# EAGLE design groundControl (EAGLE 9.5.1)
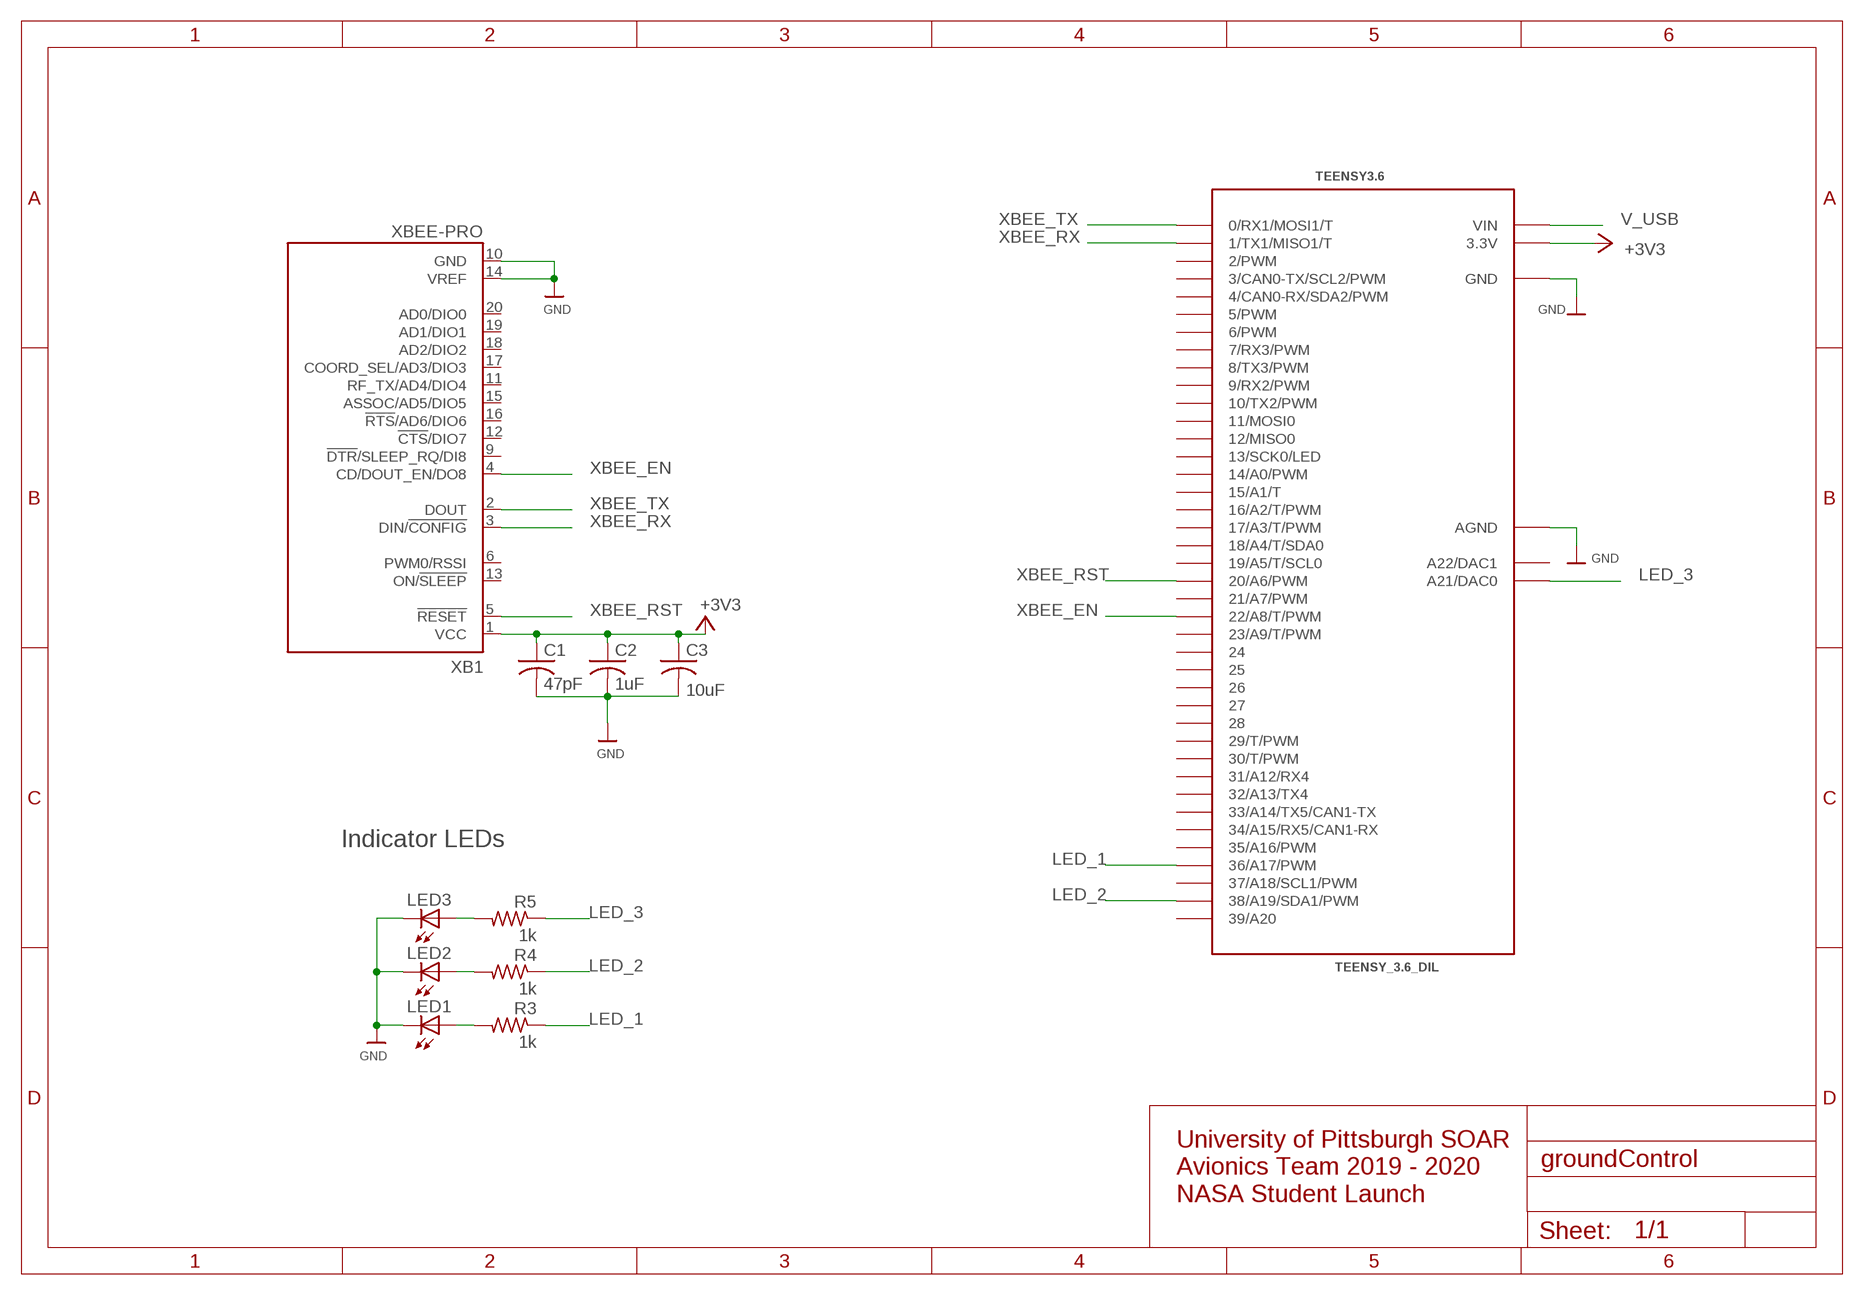
[diagram p0: schematic, sheet 1]

## Parts
C1  47pF  C-US025-040X050  [C025-040X050]
C2  1uF  C-US025-040X050  [C025-040X050]
C3  10uF  C-US025-040X050  [C025-040X050]
LED1  LED3MM  [LED3MM]
LED2  LED3MM  [LED3MM]
LED3  LED3MM  [LED3MM]
R3  1k  R-US_0309/10  [0309/10]
R4  1k  R-US_0309/10  [0309/10]
R5  1k  R-US_0309/10  [0309/10]
TEENSY3.6  TEENSY_3.6_DIL  [TEENSY_3.6_DIL]
XB1  XBEE-PRO  [XBEE-PRO]

## Nets
+3V3: C1.1 C2.1 C3.1 TEENSY3.6.3.3V TEENSY3.6.3.3V3(3.3V) XB1.1(VCC)
GND: C1.2 C2.2 C3.2 LED1.K(C) LED2.K(C) LED3.K(C) TEENSY3.6.AGND TEENSY3.6.GND TEENSY3.6.GND1(GND) XB1.10(GND) XB1.14(VREF)
LED_1: R3.1 TEENSY3.6.36/A17(36/A17/PWM)
LED_2: R4.1 TEENSY3.6.38/A19(38/A19/SDA1/PWM)
LED_3: R5.1 TEENSY3.6.A21(A21/DAC0)
N$7: LED1.A R3.2
N$8: LED2.A R4.2
N$13: LED3.A R5.2
V_USB: TEENSY3.6.VIN
XBEE_EN: TEENSY3.6.22/A8(22/A8/T/PWM) XB1.4(CD/DOUT_EN/DO8)
XBEE_RST: TEENSY3.6.20/A6(20/A6/PWM) XB1.5(!RESET)
XBEE_RX: TEENSY3.6.1(1/TX1/MISO1/T) XB1.3(DIN/!CONFIG)
XBEE_TX: TEENSY3.6.0(0/RX1/MOSI1/T) XB1.2(DOUT)
Unconnected: TEENSY3.6.2(2/PWM) TEENSY3.6.3(3/CAN0-TX/SCL2/PWM) TEENSY3.6.4(4/CAN0-RX/SDA2/PWM) TEENSY3.6.5(5/PWM) TEENSY3.6.6(6/PWM) TEENSY3.6.7(7/RX3/PWM) TEENSY3.6.8(8/TX3/PWM) TEENSY3.6.9(9/RX2/PWM) TEENSY3.6.10(10/TX2/PWM) TEENSY3.6.11(11/MOSI0) TEENSY3.6.12(12/MISO0) TEENSY3.6.13(13/SCK0/LED) TEENSY3.6.14/A0(14/A0/PWM) TEENSY3.6.15/A1(15/A1/T) TEENSY3.6.16/A2(16/A2/T/PWM) TEENSY3.6.17/A3(17/A3/T/PWM) TEENSY3.6.18/A4(18/A4/T/SDA0) TEENSY3.6.19/A5(19/A5/T/SCL0) TEENSY3.6.21/A7(21/A7/PWM) TEENSY3.6.23/A9(23/A9/T/PWM) TEENSY3.6.24 TEENSY3.6.25 TEENSY3.6.26 TEENSY3.6.27 TEENSY3.6.28 TEENSY3.6.29(29/T/PWM) TEENSY3.6.30(30/T/PWM) TEENSY3.6.31/A12(31/A12/RX4) TEENSY3.6.32/A13(32/A13/TX4) TEENSY3.6.33/A14(33/A14/TX5/CAN1-TX) TEENSY3.6.34/A15(34/A15/RX5/CAN1-RX) TEENSY3.6.35/A16(35/A16/PWM) TEENSY3.6.37/A18(37/A18/SCL1/PWM) TEENSY3.6.39/A20 TEENSY3.6.A22(A22/DAC1) XB1.6(PWM0/RSSI) XB1.9(!DTR!/SLEEP_RQ/DI8) XB1.11(RF_TX/AD4/DIO4) XB1.12(!CTS!/DIO7) XB1.13(ON/!SLEEP) XB1.15(ASSOC/AD5/DIO5) XB1.16(!RTS!/AD6/DIO6) XB1.17(COORD_SEL/AD3/DIO3) XB1.18(AD2/DIO2) XB1.19(AD1/DIO1) XB1.20(AD0/DIO0)

## Notes on the sheet
- Indicator LEDs
- University of Pittsburgh SOAR
  Avionics Team 2019 - 2020
  NASA Student Launch

## Library data of the parts
C1-C3 = adafruit:C-US: CAPACITOR, American symbol
LED1-LED3 = adafruit:LED: LED OSRAM: - CHIPLED LG R971, LG N971, LY N971, LG Q971, LY Q971, LO R971, LY R971 LH N974, LH R974 LS Q976, LO Q976, LY Q976 LO Q996 - Hyper CHIPLED LW Q18S LB Q993, LB Q99A, LB R99A - SideLED LS A670, LO A670, LY A670, LG A670, LP A670 LB A673, LV A673, LT A673, LW A673 LH A674 LY A675 LS A676, LA A676, LO A676, LY A676, LW A676 LS A679, LY A679, LG A679 - Hyper Micro SIDELED® LS Y876, LA Y876, LO Y876, LY Y876 LT Y87S - SmartLED LW L88C, LW L88S LB L89C, LB L89S, LG L890 LS L89K, LO L89K, LY L89K LS L896, LA L896, LO L896, LY L896 - TOPLED LS T670, LO T670, LY T670, LG T670, LP T670 LSG T670, LSP T670, LSY T670, LOP T670, LYG T670 LG T671, LOG T671, LSG T671 LB T673, LV T673, LT T673, LW T673 LH T674 LS T676, LA T676, LO T676, LY T676, LB T676, LH T676, LSB T676, LW T676 LB T67C, LV T67C, LT T67C, LS T67K, LO T67K, LY T67K, LW E67C LS E67B, LA E67B, LO E67B, LY E67B, LB E67C, LV E67C, LT E67C LW T67C LS T679, LY T679, LG T679 LS T770, LO T770, LY T770, LG T770, LP T770 LB T773, LV T773, LT T773, LW T773 LH T774 LS E675, LA E675, LY E675, LS T675 LS T776, LA T776, LO T776, LY T776, LB T776 LHGB T686 LT T68C, LB T68C - Hyper Mini TOPLED® LB M676 - Mini TOPLED Santana® LG M470 LS M47K, LO M47K, LY M47K Source: http://www.osram.convergy.de/
R3-R5 = resistor:R-US_: RESISTOR, American symbol
TEENSY3.6 = Teensy_3_and_LC_Series_Boards_v1.4:TEENSY_3.6_DIL: Teensy 3.6 DIL Package
XB1 = maxstream:XBEE: XBee (TM) /XBee-PRO(TM) OEM RF Modules Source: MaxStream, Inc. xbee_productmanual.pdf; MPN: XBP24-AWI-001; OC_FARNELL: 1337916; OC_NEWARK: 42M2667

## Board
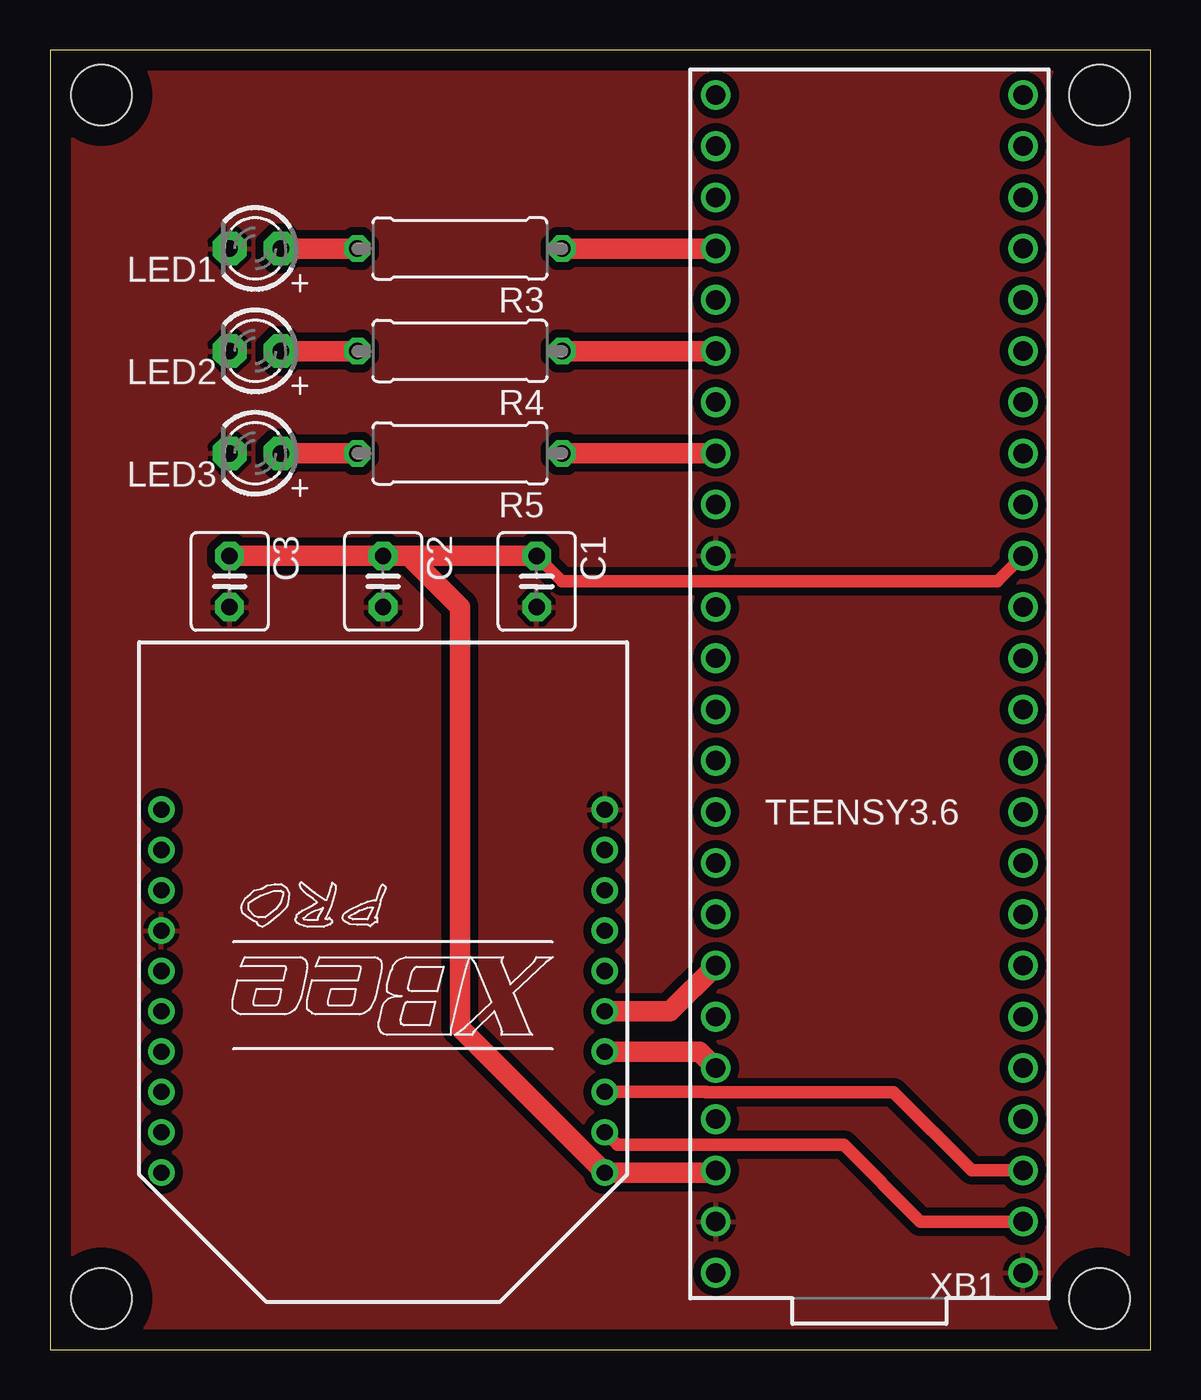
[diagram p1: board, top side]
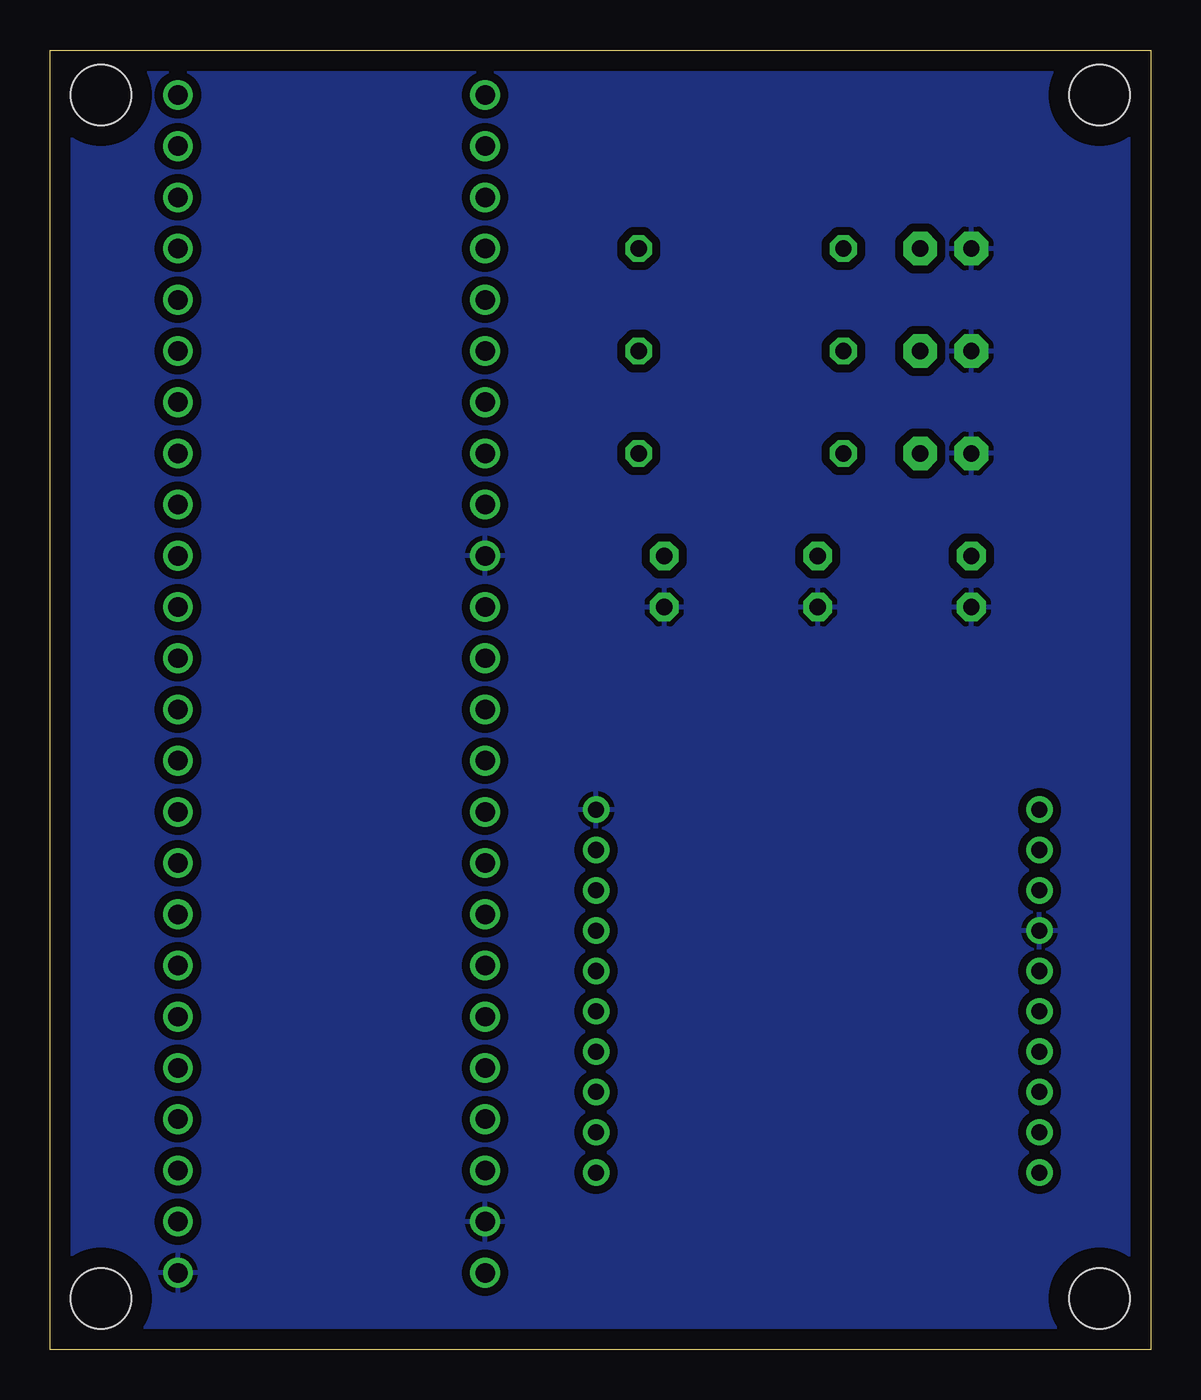
[diagram p2: board, bottom side, seen from below]

Size 54.59 x 64.44 mm. Coordinates in mm from the lower left corner, seen from the top.
Outline: 0,0 54.59,0 54.59,64.44 0,64.44 0,0
Copper layers (1*16): Top 0.035mm / dielectric 1.5mm / Bottom 0.035mm
Design rules "default": minimum track width 6mil, minimum drill 0.35mm, track to track 6mil, track to pad 6mil, pad to pad 6mil, via to via 6mil, smd to smd 6mil, copper to edge 40mil, drill to drill 6mil, minimum pad ring 10mil, minimum via ring 8mil, stop-mask expansion 4mil, vias tented up to drill 0mil, thermal gap 10mil
Holes 3 mm at 52.07,2.54 2.54,2.54 2.54,62.23 52.07,62.23

### Footprints (pad centres in the part's own frame; a part is rotated, then mirrored left to right if it is on the bottom)
C025-040X050 = drill 0.813 pad 1.422 octagon: 1 -1.27,0; 2 1.27,0
LED3MM = drill 0.813 pad 1.676 octagon: A -1.27,0; K 1.27,0
0309/10 = drill 0.813 octagon: 1 -5.08,0; 2 5.08,0
TEENSY_3.6_DIL = drill 0.965: 0 -7.62,25.4; 1 -7.62,22.86; 2 -7.62,20.32; 3 -7.62,17.78; 3.3V 7.62,22.86; 3.3V3 -7.62,-7.62; 4 -7.62,15.24; 5 -7.62,12.7; 6 -7.62,10.16; 7 -7.62,7.62; 8 -7.62,5.08; 9 -7.62,2.54; 10 -7.62,0; 11 -7.62,-2.54; 12 -7.62,-5.08; 13 7.62,-5.08; 14/A0 7.62,-2.54; 15/A1 7.62,0; 16/A2 7.62,2.54; 17/A3 7.62,5.08; 18/A4 7.62,7.62; 19/A5 7.62,10.16; 20/A6 7.62,12.7; 21/A7 7.62,15.24; 22/A8 7.62,17.78; 23/A9 7.62,20.32; 24 -7.62,-10.16; 25 -7.62,-12.7; 26 -7.62,-15.24; 27 -7.62,-17.78; 28 -7.62,-20.32; 29 -7.62,-22.86; 30 -7.62,-25.4; 31/A12 -7.62,-27.94; 32/A13 -7.62,-30.48; 33/A14 7.62,-30.48; 34/A15 7.62,-27.94; 35/A16 7.62,-25.4; 36/A17 7.62,-22.86; 37/A18 7.62,-20.32; 38/A19 7.62,-17.78; 39/A20 7.62,-15.24; A21 7.62,-12.7; A22 7.62,-10.16; AGND 7.62,25.4; GND -7.62,27.94; GND1 7.62,-7.62; VIN 7.62,27.94
XBEE-PRO = drill 0.8 pad 1.27: 1 -11,9; 2 -11,7; 3 -11,5; 4 -11,3; 5 -11,1; 6 -11,-1; 7 -11,-3; 8 -11,-5; 9 -11,-7; 10 -11,-9; 11 11,-9; 12 11,-7; 13 11,-5; 14 11,-3; 15 11,-1; 16 11,1; 17 11,3; 18 11,5; 19 11,7; 20 11,9

### Placement (x,y rotation side)
C1  24.13,38.1 270 top
C2  16.51,38.1 270 top
C3  8.89,38.1 270 top
LED1  10.16,54.61 180 top
LED2  10.16,49.53 180 top
LED3  10.16,44.45 180 top
R3  20.32,54.61 180 top
R4  20.32,49.53 180 top
R5  20.32,44.45 180 top
TEENSY3.6  40.64,31.75 180 top
XB1  16.51,17.78 180 top

### Tracks (layer width: path | path; a pad name or v marks a point on that pad's centre or on a via)
+3V3
  Top 0.61: TEENSY3.6.3.3V3 46.99,38.1 25.4,38.1 C1.1
  Top 1.016: C3.1 C2.1 | C1.1 C2.1 | TEENSY3.6.3.3V 32.91,8.78 XB1.1 20.32,15.97 20.32,36.83 17.78,39.37 C2.1
GND
  pour Top (isolate 0.406): 0,64.77 54.61,64.77 54.61,0 0,0
  pour Bottom (isolate 0.406): 0,64.77 54.61,64.77 54.61,0 0,0
LED_1
  Top 1.016: TEENSY3.6.36/A17 R3.1
LED_2
  Top 1.016: TEENSY3.6.38/A19 R4.1
LED_3
  Top 1.016: TEENSY3.6.A21 R5.1
N$7
  Top 1.016: R3.2 LED1.A
N$8
  Top 1.016: R4.2 LED2.A
N$13
  Top 1.016: R5.2 LED3.A
XBEE_EN
  Top 1.016: XB1.4 32.21,14.78 TEENSY3.6.22/A8
XBEE_RST
  Top 1.016: XB1.5 30.75,16.78 TEENSY3.6.20/A6
XBEE_RX
  Top 0.61: XB1.3 32.52,12.78 32.53,12.78 41.83,12.78 45.72,8.89 TEENSY3.6.1
XBEE_TX
  Top 0.61: XB1.2 28.13,10.16 39.37,10.16 43.18,6.35 TEENSY3.6.0